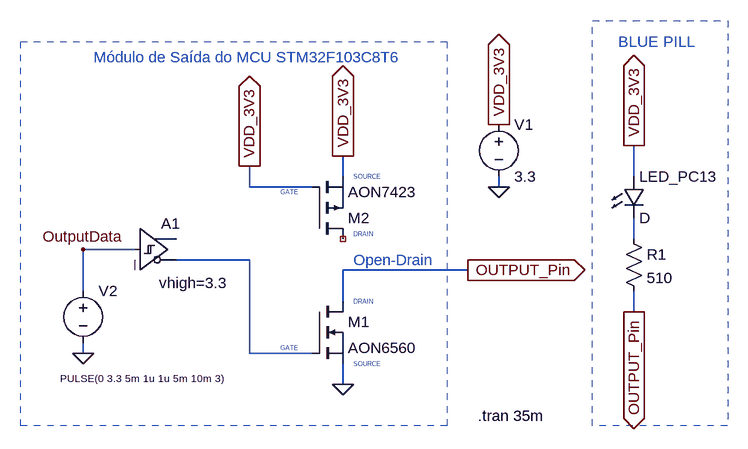
[diagram p0: schematic STM32_Output_Open-Drain.asc]
STM32_Output_Open-Drain.asc, the LTspice schematic file:
Version 4
SHEET 1 1804 680
WIRE 256 -64 256 -96
WIRE 704 -64 704 -112
WIRE 112 -48 112 -80
WIRE 208 -48 112 -48
WIRE 496 -48 496 -64
WIRE 704 32 704 0
WIRE -64 48 -144 48
WIRE 112 64 0 64
WIRE 448 80 256 80
WIRE -144 112 -144 48
WIRE 256 128 256 80
WIRE 704 144 704 112
WIRE -144 208 -144 192
WIRE 112 208 112 64
WIRE 208 208 112 208
WIRE 256 256 256 224
FLAG 496 -48 0
FLAG 496 -144 VDD_3V3
IOPIN 496 -144 Out
FLAG 256 -96 VDD_3V3
IOPIN 256 -96 Out
FLAG 256 256 0
FLAG -144 208 0
FLAG 448 80 OUTPUT_Pin
IOPIN 448 80 Out
FLAG 704 -112 VDD_3V3
IOPIN 704 -112 Out
FLAG 704 144 OUTPUT_Pin
IOPIN 704 144 Out
FLAG 112 -80 VDD_3V3
IOPIN 112 -80 Out
FLAG -144 48 OutputData
SYMBOL voltage 496 -160 R0
WINDOW 123 0 0 Left 0
WINDOW 39 0 0 Left 0
SYMATTR InstName V1
SYMATTR Value 3.3
SYMBOL res 688 16 R0
SYMATTR InstName R1
SYMATTR Value 510
SYMBOL nmos 208 128 R0
SYMATTR InstName M1
SYMATTR Value AON6560
SYMBOL voltage -144 96 R0
WINDOW 123 0 0 Left 0
WINDOW 39 0 0 Left 0
WINDOW 3 -35 151 Left 1
SYMATTR Value PULSE(0 3.3 5m 1u 1u 5m 10m 3)
SYMATTR InstName V2
SYMBOL pmos 208 32 M180
SYMATTR InstName M2
SYMATTR Value AON7423
SYMBOL LED 688 -64 R0
SYMATTR InstName LED_PC13
SYMBOL Digital\\schmitt -64 -16 R0
WINDOW 39 37 116 Left 2
SYMATTR SpiceLine vhigh=3.3
SYMATTR InstName A1
TEXT 464 304 Left 2 !.tran 35m
TEXT -128 -248 Left 2 ;Módulo de Saída do MCU STM32F103C8T6
TEXT 272 64 Left 2 ;Open-Drain
TEXT 680 -272 Left 2 ;BLUE PILL
TEXT 272 -64 Left 0 ;SOURCE
TEXT 160 -40 Left 0 ;GATE
TEXT 160 200 Left 0 ;GATE
TEXT 272 24 Left 0 ;DRAIN
TEXT 272 128 Left 0 ;DRAIN
TEXT 272 224 Left 0 ;SOURCE
RECTANGLE Normal 416 320 -240 -272 2
RECTANGLE Normal 848 320 640 -304 2

The netlist it stands for:
* STM32_Output_Open-Drain.asc
V1 VDD_3V3 0 3.3
R1 N001 OUTPUT_Pin 510
M1 OUTPUT_Pin N002 0 0 AON6560
V2 OutputData 0 PULSE(0 3.3 5m 1u 1u 5m 10m 3)
M2 NC_01 VDD_3V3 VDD_3V3 VDD_3V3 AON7423
D§LED_PC13 VDD_3V3 N001 D
A1 OutputData 0 0 0 0 N002 0 0 SCHMITT vhigh=3.3
.model D D
.lib standard.dio
.model NMOS NMOS
.model PMOS PMOS
.lib standard.mos
.tran 35m
* Módulo de Saída do MCU STM32F103C8T6
* Open-Drain
* BLUE PILL
* SOURCE
* GATE
* GATE
* DRAIN
* DRAIN
* SOURCE
.backanno
.end